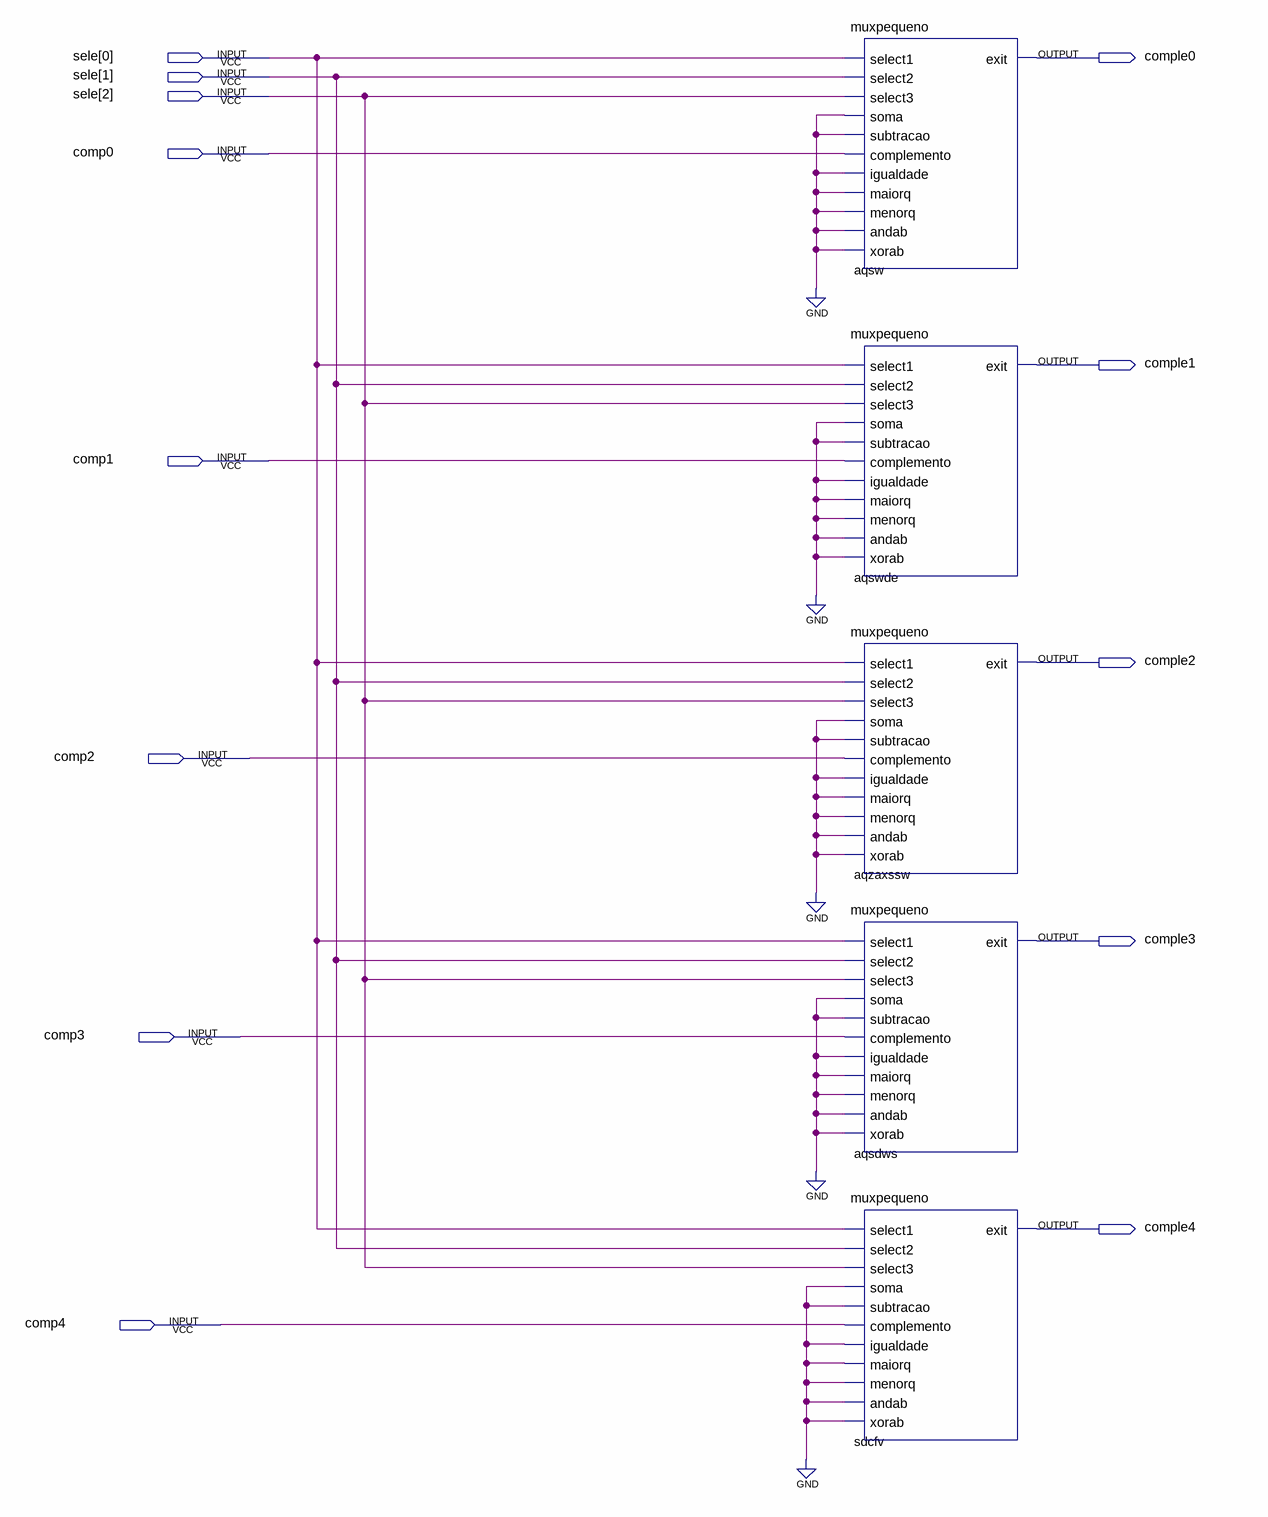
[diagram p0: schematic sheet]
// Quartus schematic muxcomplemento.bdf as structural Verilog: 5 symbols, 13 pins
module muxcomplemento (
  input  [2:0] sele,
  input  comp0,
  input  comp1,
  input  comp2,
  input  comp3,
  input  comp4,
  output comple0,
  output comple1,
  output comple2,
  output comple3,
  output comple4
);

  muxpequeno aqsw (
    .select1(sele[0]), .select2(sele[1]), .select3(sele[2]), .soma(1'b0), .subtracao(1'b0),
    .complemento(comp0), .igualdade(1'b0), .maiorq(1'b0), .menorq(1'b0), .andab(1'b0), .xorab(1'b0),
    .exit(comple0));
  muxpequeno aqswde (
    .select1(sele[0]), .select2(sele[1]), .select3(sele[2]), .soma(1'b0), .subtracao(1'b0),
    .complemento(comp1), .igualdade(1'b0), .maiorq(1'b0), .menorq(1'b0), .andab(1'b0), .xorab(1'b0),
    .exit(comple1));
  muxpequeno aqzaxssw (
    .select1(sele[0]), .select2(sele[1]), .select3(sele[2]), .soma(1'b0), .subtracao(1'b0),
    .complemento(comp2), .igualdade(1'b0), .maiorq(1'b0), .menorq(1'b0), .andab(1'b0), .xorab(1'b0),
    .exit(comple2));
  muxpequeno aqsdws (
    .select1(sele[0]), .select2(sele[1]), .select3(sele[2]), .soma(1'b0), .subtracao(1'b0),
    .complemento(comp3), .igualdade(1'b0), .maiorq(1'b0), .menorq(1'b0), .andab(1'b0), .xorab(1'b0),
    .exit(comple3));
  muxpequeno sdcfv (
    .select1(sele[0]), .select2(sele[1]), .select3(sele[2]), .soma(1'b0), .subtracao(1'b0),
    .complemento(comp4), .igualdade(1'b0), .maiorq(1'b0), .menorq(1'b0), .andab(1'b0), .xorab(1'b0),
    .exit(comple4));
endmodule
